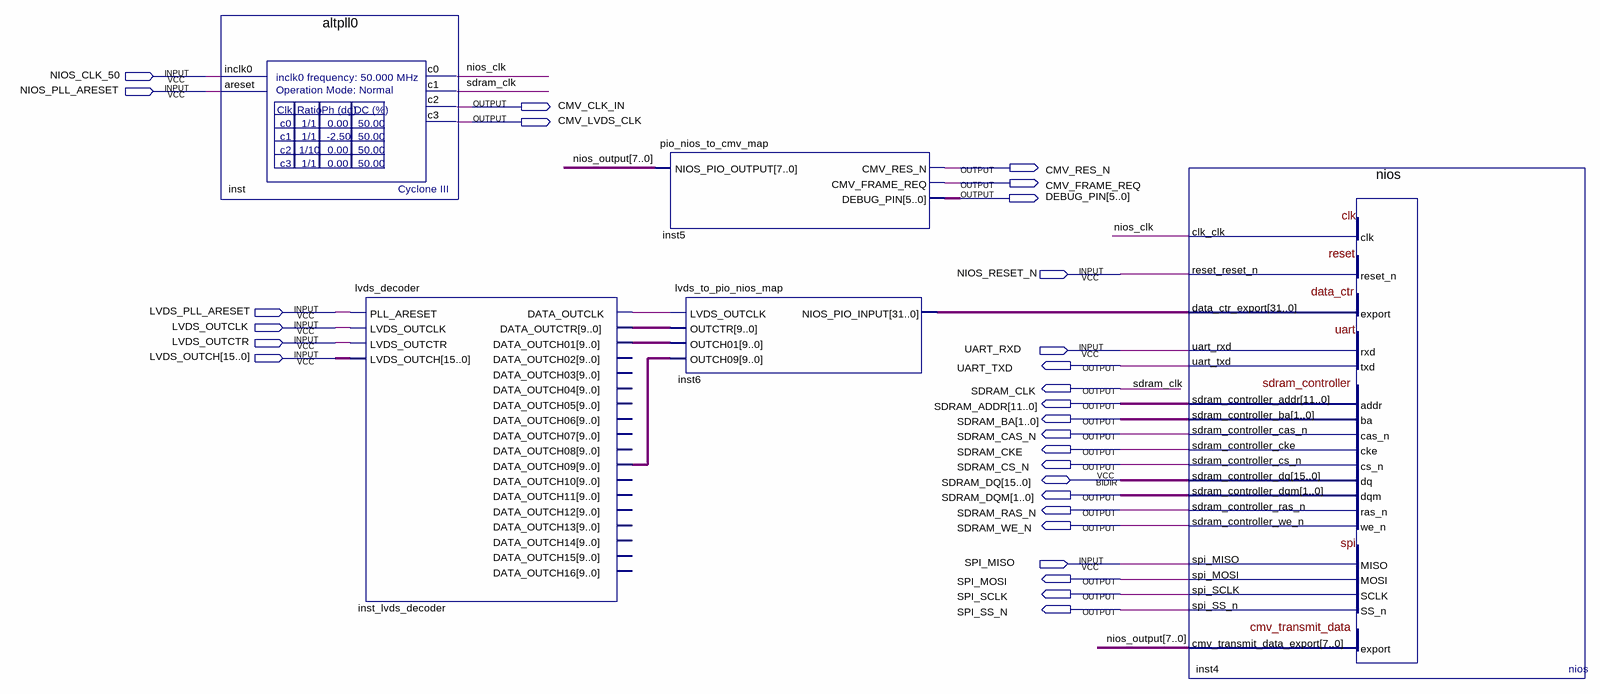
[diagram p0: schematic sheet]
// Quartus schematic cmv_controller.bdf as structural Verilog: 5 symbols, 28 pins
module cmv_controller (
  input  NIOS_CLK_50,
  input  NIOS_PLL_ARESET,
  input  NIOS_RESET_N,
  input  LVDS_PLL_ARESET,
  input  LVDS_OUTCLK,
  input  LVDS_OUTCTR,
  input  UART_RXD,
  input  [15:0] LVDS_OUTCH,
  input  SPI_MISO,
  inout  [15:0] SDRAM_DQ,
  output CMV_CLK_IN,
  output CMV_LVDS_CLK,
  output CMV_RES_N,
  output CMV_FRAME_REQ,
  output [5:0] DEBUG_PIN,
  output UART_TXD,
  output SDRAM_CLK,
  output [11:0] SDRAM_ADDR,
  output [1:0] SDRAM_BA,
  output SDRAM_CAS_N,
  output SDRAM_CKE,
  output SDRAM_CS_N,
  output [1:0] SDRAM_DQM,
  output SDRAM_RAS_N,
  output SDRAM_WE_N,
  output SPI_MOSI,
  output SPI_SCLK,
  output SPI_SS_N
);

  wire inst_lvds_decoder_data_outclk, nios_clk;
  wire [7:0] nios_output;
  wire [9:0] inst_lvds_decoder_data_outch01, inst_lvds_decoder_data_outch09, inst_lvds_decoder_data_outctr;
  wire [31:0] inst6_nios_pio_input;

  altpll0 inst (
    .inclk0(NIOS_CLK_50), .areset(NIOS_PLL_ARESET), .c0(nios_clk), .c1(SDRAM_CLK), .c2(CMV_CLK_IN),
    .c3(CMV_LVDS_CLK));
  lvds_decoder inst_lvds_decoder (
    .PLL_ARESET(LVDS_PLL_ARESET), .LVDS_OUTCLK(LVDS_OUTCLK), .LVDS_OUTCTR(LVDS_OUTCTR),
    .LVDS_OUTCH(LVDS_OUTCH), .DATA_OUTCLK(inst_lvds_decoder_data_outclk),
    .DATA_OUTCTR(inst_lvds_decoder_data_outctr), .DATA_OUTCH01(inst_lvds_decoder_data_outch01),
    .DATA_OUTCH09(inst_lvds_decoder_data_outch09));  // open: DATA_OUTCH02, DATA_OUTCH03, DATA_OUTCH04, DATA_OUTCH05, DATA_OUTCH06, DATA_OUTCH07, DATA_OUTCH08, DATA_OUTCH10, DATA_OUTCH11, DATA_OUTCH12, DATA_OUTCH13, DATA_OUTCH14, DATA_OUTCH15, DATA_OUTCH16
  pio_nios_to_cmv_map inst5 (
    .NIOS_PIO_OUTPUT(nios_output), .CMV_RES_N(CMV_RES_N), .CMV_FRAME_REQ(CMV_FRAME_REQ), .DEBUG_PIN(DEBUG_PIN));
  lvds_to_pio_nios_map inst6 (
    .LVDS_OUTCLK(inst_lvds_decoder_data_outclk), .OUTCTR(inst_lvds_decoder_data_outctr),
    .OUTCH01(inst_lvds_decoder_data_outch01), .OUTCH09(inst_lvds_decoder_data_outch09),
    .NIOS_PIO_INPUT(inst6_nios_pio_input));
  nios inst4 (
    .clk_clk(nios_clk), .reset_reset_n(NIOS_RESET_N), .data_ctr_export(inst6_nios_pio_input),
    .uart_rxd(UART_RXD), .spi_MISO(SPI_MISO), .uart_txd(UART_TXD), .sdram_controller_addr(SDRAM_ADDR),
    .sdram_controller_ba(SDRAM_BA), .sdram_controller_cas_n(SDRAM_CAS_N), .sdram_controller_cke(SDRAM_CKE),
    .sdram_controller_cs_n(SDRAM_CS_N), .sdram_controller_dqm(SDRAM_DQM),
    .sdram_controller_ras_n(SDRAM_RAS_N), .sdram_controller_we_n(SDRAM_WE_N), .spi_MOSI(SPI_MOSI),
    .spi_SCLK(SPI_SCLK), .spi_SS_n(SPI_SS_N), .cmv_transmit_data_export(nios_output),
    .sdram_controller_dq(SDRAM_DQ));
endmodule
